# Altium schematic sheet Current_Driver_2.SchDoc
size A
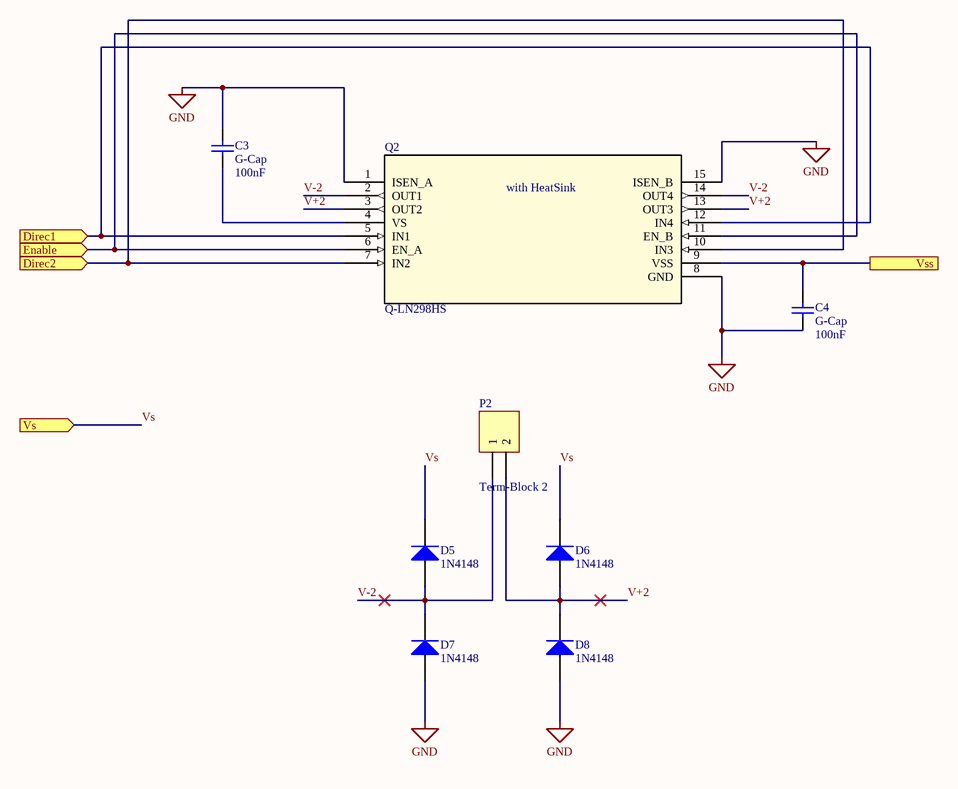
[diagram p0: Current_Driver_2.SchDoc]

## Parts
C3  G-Cap  value 100nF  [Cap2.54mm_LGE1.0]
C4  G-Cap  value 100nF  [Cap2.54mm_LGE1.0]
D5  1N4148  [DO-41_XLGE1.2]
D6  1N4148  [DO-41_XLGE1.2]
D7  1N4148  [DO-41_XLGE1.2]
D8  1N4148  [DO-41_XLGE1.2]
P2  Term-Block 2  [TERM-BLOCK-5.08MM-2POS]
Q2  Q-LN298HS  [Multiwatt15_V_ELEC391HS]

## Ports
Direc1 (in), Direc2 (in), Enable (in), Vs (in), Vss

## Nets
GND: C3.2 C4.1 D7.1(A) D8.1(A) Q2.1(ISEN_A) Q2.8(GND) Q2.15(ISEN_B)
Direc1: Q2.5(IN1) Q2.12(IN4) ; port Direc1
Direc2: Q2.7(IN2) Q2.10(IN3) ; port Direc2
Enable: Q2.6(EN_A) Q2.11(EN_B) ; port Enable
V+2: D6.1(A) D8.2(K) P2.2 Q2.3(OUT2) Q2.13(OUT3)
V-2: D5.1(A) D7.2(K) P2.1 Q2.2(OUT1) Q2.14(OUT4)
Vs: D5.2(K) D6.2(K) ; port Vs
Vss: C4.2 Q2.9(VSS) ; port Vss
NetC3_1: C3.1 Q2.4(VS)

## Notes on the sheet
- (in symbol Q-LN298HS) with HeatSink

## Library data of the parts
C3 C4 = G-Cap: Capacitor (specify value); Published: 8-Jun-2000; LatestRevisionDate: 17-Jul-2002; LatestRevisionNote: Re-released for DXP Platform.; PackageReference: RAD-0.3; Publisher: Altium Limited
D5-D8 = T-DiodeRect: High-speed Diode; ComponentLink1URL: http://www.mccsemi.com/up_pdf/1N4148(DO-35).pdf; ComponentLink1Description: Datasheet (ELEC391)
P2 = C-Block2: Terminal-Block 1x2; LatestRevisionDate: 17-Jul-2002; LatestRevisionNote: Re-released for DXP Platform.; Publisher: Altium Limited
Q2 = Q-LN298HS: LN298 - IC Bridge Driver Par 15Multiwatt; Manufacturer_Part_Number: L298N; Vendor: ST Microelectronics; Input Type: Non-Inverting; Number of Outputs: 4; Current - Output / Channel: 2A; Current - Peak Output: 3A; Voltage - Supply: 4.5 V ~ 46 V; C: Copyright (C) 2015 Accelerated Designs. All rights reserved; Quantity_Available: 5651; DataSheet: http://www.st.com/internet/com/TECHNICAL_RESOURCES/TECHNICAL_LITERATURE/DATASHEET/CD00000240.pdf; Type: Type; On-State Resistance: -; Operating Temperature: -25Â°C ~ 130Â°C; Mounting Type: Through Hole; Package / Case: Multiwatt-15 (Vertical, Bent and Staggered Leads); Supplier Device Package: 15-Multiwatt; Packaging: Tube; Copyright: Copyright (C) 2015 Accelerated Designs. All rights reserved; RefDes: RefDes; Value: Value; ComponentLink1URL: http://www.st.com/content/ccc/resource/technical/document/datasheet/82/cc/3f/39/0a/29/4d/f0/CD00000240.pdf/files/CD00000240.pdf/jcr:content/translations/en.CD00000240.pdf; ComponentLink1Description: Datasheet (ELEC391)